# Altium schematic sheet daughterboardFunkySwitch.SchDoc
size A4
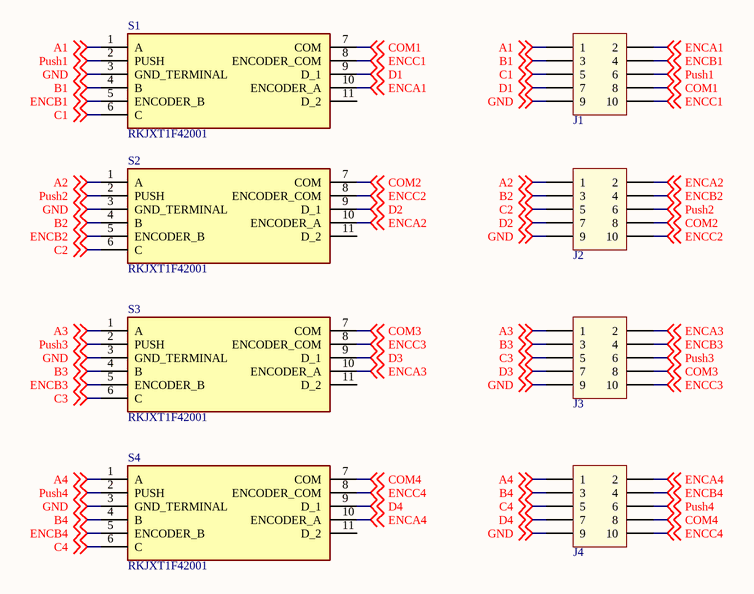
[diagram p0: daughterboardFunkySwitch.SchDoc]

## Parts
J1  61301021821  [61301021821]  (value not drawn)
J2  61301021821  [61301021821]  (value not drawn)
J3  61301021821  [61301021821]  (value not drawn)
J4  61301021821  [61301021821]  (value not drawn)
S1  RKJXT1F42001  [RKJXT1F42001]
S2  RKJXT1F42001  [RKJXT1F42001]
S3  RKJXT1F42001  [RKJXT1F42001]
S4  RKJXT1F42001  [RKJXT1F42001]

## Nets
A1: J1.1 S1.1(A) ; off-sheet A1
A2: J2.1 S2.1(A) ; off-sheet A2
A3: J3.1 S3.1(A) ; off-sheet A3
A4: J4.1 S4.1(A) ; off-sheet A4
B1: J1.3 S1.4(B) ; off-sheet B1
B2: J2.3 S2.4(B) ; off-sheet B2
B3: J3.3 S3.4(B) ; off-sheet B3
B4: J4.3 S4.4(B) ; off-sheet B4
C1: J1.5 S1.6(C) ; off-sheet C1
C2: J2.5 S2.6(C) ; off-sheet C2
C3: J3.5 S3.6(C) ; off-sheet C3
C4: J4.5 S4.6(C) ; off-sheet C4
COM1: J1.8 S1.7(COM) ; off-sheet COM1
COM2: J2.8 S2.7(COM) ; off-sheet COM2
COM3: J3.8 S3.7(COM) ; off-sheet COM3
COM4: J4.8 S4.7(COM) ; off-sheet COM4
D1: J1.7 S1.9(D_1) ; off-sheet D1
D2: J2.7 S2.9(D_1) ; off-sheet D2
D3: J3.7 S3.9(D_1) ; off-sheet D3
D4: J4.7 S4.9(D_1) ; off-sheet D4
ENCA1: J1.2 S1.10(ENCODER_A) ; off-sheet ENCA1
ENCA2: J2.2 S2.10(ENCODER_A) ; off-sheet ENCA2
ENCA3: J3.2 S3.10(ENCODER_A) ; off-sheet ENCA3
ENCA4: J4.2 S4.10(ENCODER_A) ; off-sheet ENCA4
ENCB1: J1.4 S1.5(ENCODER_B) ; off-sheet ENCB1
ENCB2: J2.4 S2.5(ENCODER_B) ; off-sheet ENCB2
ENCB3: J3.4 S3.5(ENCODER_B) ; off-sheet ENCB3
ENCB4: J4.4 S4.5(ENCODER_B) ; off-sheet ENCB4
ENCC1: J1.10 S1.8(ENCODER_COM) ; off-sheet ENCC1
ENCC2: J2.10 S2.8(ENCODER_COM) ; off-sheet ENCC2
ENCC3: J3.10 S3.8(ENCODER_COM) ; off-sheet ENCC3
ENCC4: J4.10 S4.8(ENCODER_COM) ; off-sheet ENCC4
GND: J1.9 J2.9 J3.9 J4.9 S1.3(GND_TERMINAL) S2.3(GND_TERMINAL) S3.3(GND_TERMINAL) S4.3(GND_TERMINAL) ; off-sheet GND
Push1: J1.6 S1.2(PUSH) ; off-sheet Push1
Push2: J2.6 S2.2(PUSH) ; off-sheet Push2
Push3: J3.6 S3.2(PUSH) ; off-sheet Push3
Push4: J4.6 S4.2(PUSH) ; off-sheet Push4

Not connected (* = marked no-connect by the designer): S1 11(D_2); S2 11(D_2); S3 11(D_2); S4 11(D_2)

## Library data of the parts
J1-J4 = 61301021821: WR-PHD 2.54 mm Dual Socket Header, 10p; Pin Number: 10; Rated Current: 3A; Working Voltage: 250V AC; Withstanding Voltage: 500V AC; Pitch: 2.54mm; ComponentLink1Description: Manufacturer; ComponentLink1URL: http://www.we-online.de; ComponentLink2Description: Datasheet; ComponentLink2URL: http://katalog.we-online.de/em/datasheet/6130xx21821.pdf; Part Number: 61301021821; Published Date: August 2017; Publisher: Wurth Elektronik
S1-S4 = RKJXT1F42001: Switch; Manufacturer_Name: ALPS; Datasheet Link: http://www.alps.com/prod/info/E/HTML/MultiControl/Switch/RKJXT/RKJXT1F42001.html; Height: 17mm; Mouser2 Part Number: 688-RKJXT1F42001; Mouser2 Price/Stock: https://www.mouser.com/Search/Refine.aspx?Keyword=688-RKJXT1F42001; Manufacturer_Part_Number: RKJXT1F42001